# EAGLE design OEMV1_GPS_Interface (EAGLE 6.3)
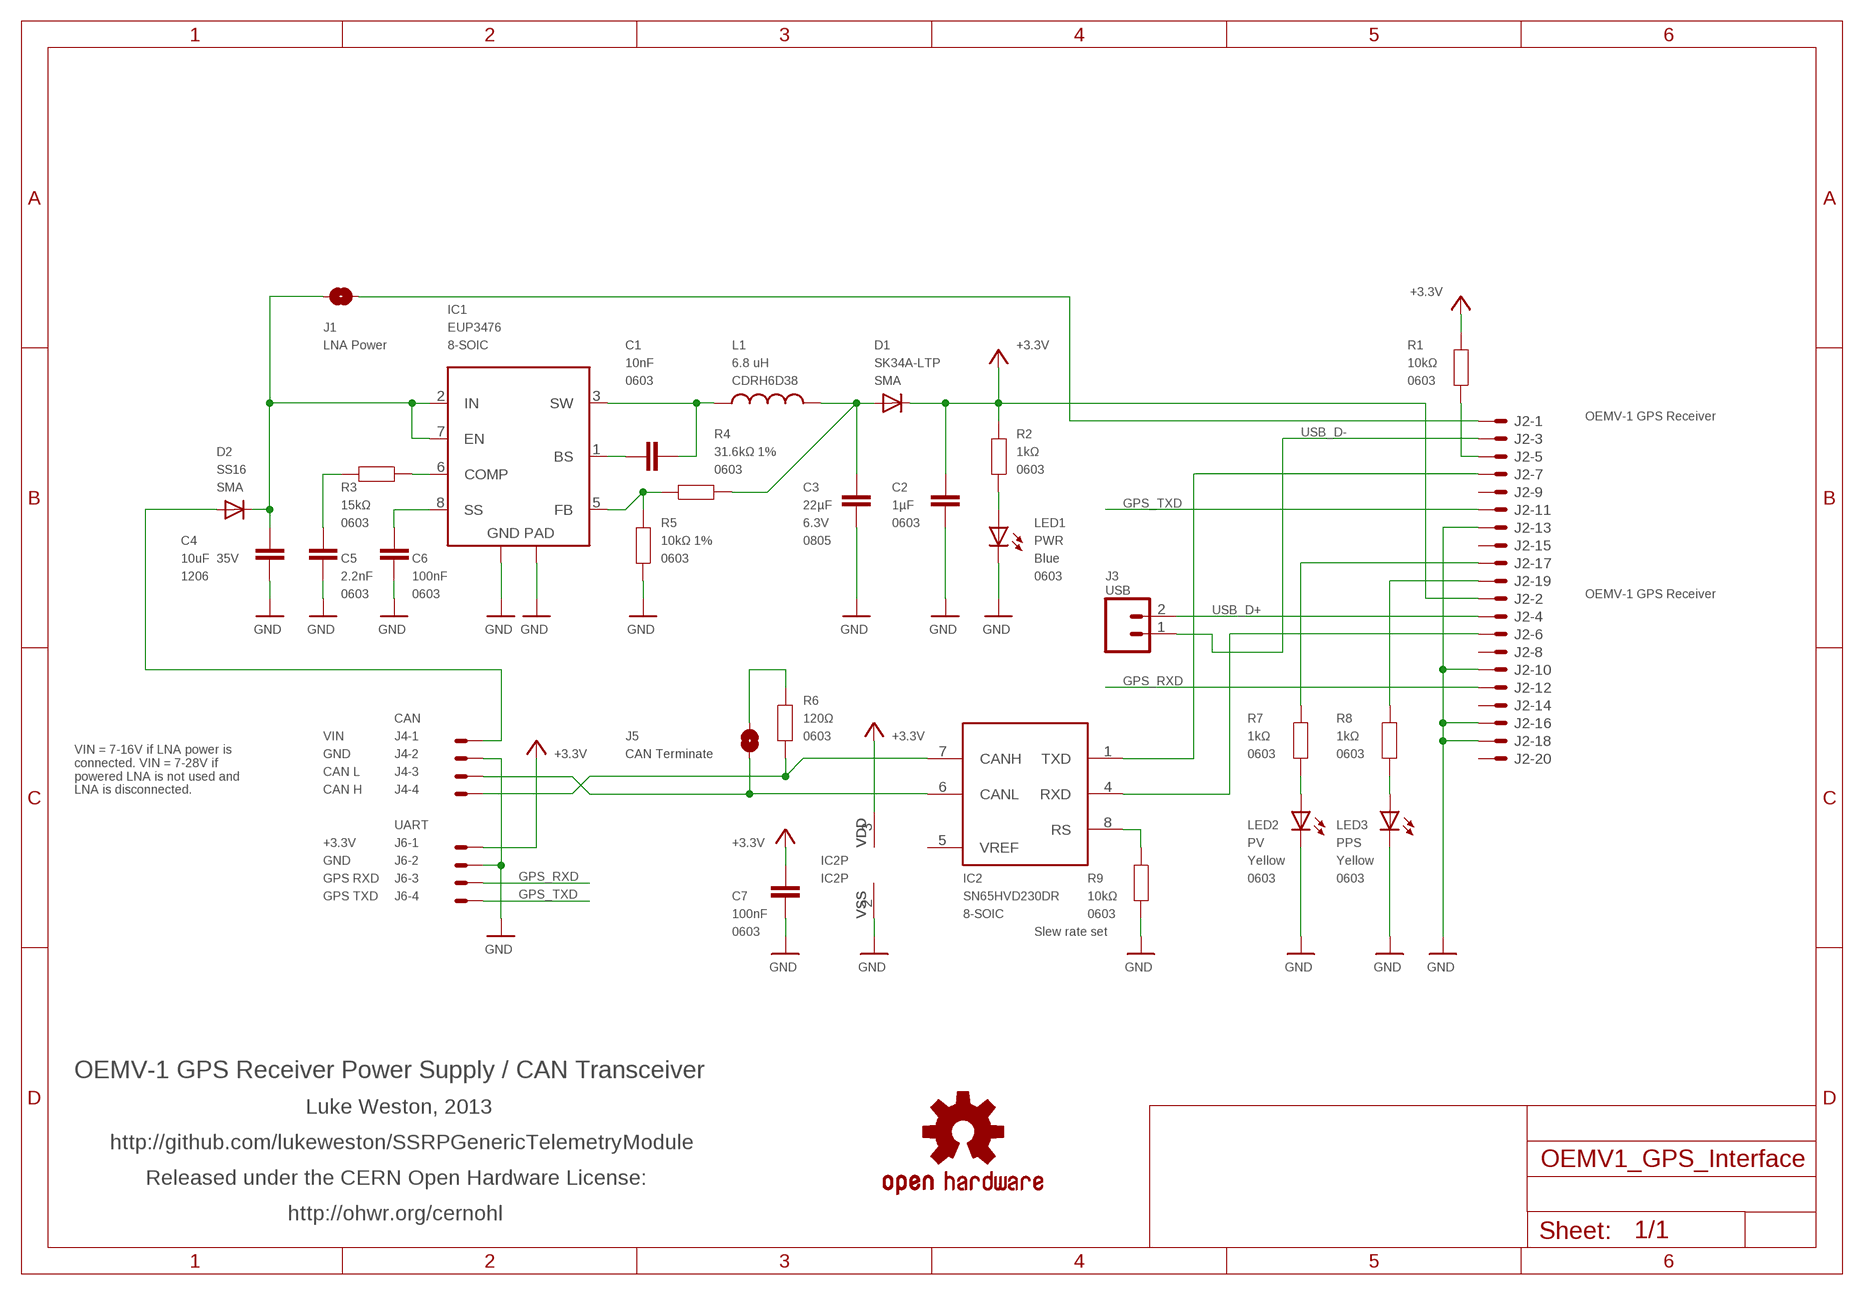
[diagram p0: schematic, sheet 1]

## Parts
C1  10nF  CAP0603  [0603]
C2  1µF  CAP0603  [0603]
C3  22µF  CAP0805  [0805]
C4  10uF  C-EUC1206  [C1206]
C5  2.2nF  CAP0603  [0603]
C6  100nF  CAP0603  [0603]
C7  100nF  CAP0603  [0603]
D1  SK34A-LTP  DIODESMA  [SMA-DIODE]
D2  SS16  DIODESMA  [SMA-DIODE]
IC1  EUP3476  [SO08T]
IC2  SN65HVD230DR  MCP2551SN  [SO-08]
J1  LNA Power  SJ  [SJ]
J2  OEMV-1 GPS Receiver  87758-2016  [87758-2016]
J3  USB  M02PTH  [1X02]
J4  CAN  22-23-2041  [22-23-2041]
J5  CAN Terminate  SJ  [SJ]
J6  UART  22-23-2041  [22-23-2041]
L1  6.8 uH  INDUCTOR  [CDRH]
LED1  PWR  LED0603  [LED-0603]
LED2  PV  LED0603  [LED-0603]
LED3  PPS  LED0603  [LED-0603]
R1  10kΩ  RESISTOR0603  [0603]
R2  1kΩ  RESISTOR0603  [0603]
R3  15kΩ  RESISTOR0603  [0603]
R4  31.6kΩ 1%  RESISTOR0603  [0603]
R5  10kΩ 1%  RESISTOR0603  [0603]
R6  120Ω  RESISTOR0603  [0603]
R7  1kΩ  RESISTOR0603  [0603]
R8  1kΩ  RESISTOR0603  [0603]
R9  10kΩ  RESISTOR0603  [0603]
SY  OSHW-LOGOS  [OSHW-LOGO-S]

## Nets
!RESET: J2.5 R1.2
+3.3V: C2.2 C7.2 D1.C IC2.3(VDD) J2.2 J6.1 R1.1 R2.1
CANH: IC2.7(CANH) J4.4 R6.1
CANL: IC2.6(CANL) J4.3 J5.2
GND: C2.1 C3.2 C4.2 C5.1 C6.1 C7.1 IC1.4(GND) IC1.9(TGND) IC2.2(VSS) J2.10 J2.13 J2.16 J2.18 J4.2 J6.2 LED1.C LED2.C LED3.C R5.2 R9.2
GPS_CAN_RX: IC2.4(RXD) J2.6
GPS_CAN_TX: IC2.1(TXD) J2.7
GPS_RXD: J2.12 J6.3
GPS_TXD: J2.11 J6.4
N$1: LED2.A R7.1
N$2: LED3.A R8.1
N$3: C1.2 IC1.1(BS)
N$4: D2.A J4.1
N$5: J5.1 R6.2
N$6: C5.2 R3.2
N$7: C3.1 D1.A L1.2 R4.2
N$9: LED1.A R2.2
N$11: C4.1 D2.C IC1.2(IN) IC1.7(EN) J1.1
N$18: C1.1 IC1.3(SW) L1.1
N$21: IC1.6(COMP) R3.1
N$22: C6.2 IC1.8(SS)
N$23: IC1.5(FB) R4.1 R5.1
N$87: IC2.8(RS) R9.1
PPS_OUT: J2.19 R8.2
PV_OUT: J2.17 R7.2
USB_D+: J2.4 J3.2
USB_D-: J2.3 J3.1
VIN: J1.2 J2.1
Unconnected: J2.8 J2.9 J2.14 J2.15 J2.20

## Notes on the sheet
- VIN
- GND
- CAN L
- VIN = 7-16V if LNA power is
  connected. VIN = 7-28V if
  powered LNA is not used and
  LNA is disconnected.
- CAN H
- +3.3V
- GND
- GPS RXD
- GPS TXD
- OEMV-1 GPS Receiver Power Supply / CAN Transceiver
- Luke Weston, 2013
- http://github.com/lukeweston/SSRPGenericTelemetryModule
- Released under the CERN Open Hardware License:
- http://ohwr.org/cernohl

## Power pins joined to a net without a drawn wire
VREF: IC2.5(VREF)

## Library data of the parts
C1 C2 C5-C7 = freetronics-master-v1:CAP: Capacitor Standard 0603 ceramic capacitor, and 0.1" leaded capacitor.; PACKAGE: 0603
C3 = freetronics-master-v1:CAP: Capacitor Standard 0603 ceramic capacitor, and 0.1" leaded capacitor.; PACKAGE: 0805; VOLTAGE: 6.3V
C4 = freetronics-jon:C-EU: CAPACITOR, European symbol; PACKAGE: 1206; VOLTAGE: 35V
D1 D2 = freetronics-master-v1:DIODE: Diode These are standard reverse protection diodes and small signal diodes. SMA package can handle up to about 1A. SOD-323 can handle about 200mA. What the SOD-323 package when ordering, there are some mfgs out there that are 5-pin packages.; PACKAGE: SMA
IC1 = freetronics-luke:EUP3476: EUTECH EUP3476 buck converter; PACKAGE: 8-SOIC
IC2 = microchip_can:MCP2551: High Speed CAN tranceiver; PACKAGE: 8-SOIC
J1 J5 = freetronics-luke:SJ: PCB "solder jumper". Note that there should nothing on the BOM corresponding to this "component".
J2 = con-molex:87758-2016: 20 Pin - 2mm Dual Row Single Wafer, Vertical T/H HDR Source: http://www.molex.com/pdm_docs/sd/877580616_sd.pdf; MPN: 87758-2016; OC_FARNELL: 7472374; OC_NEWARK: 25M5677
J3 = freetronics-master-v1:M02: Header 2 Standard 2-pin 0.1" header. Use with straight break away headers (SKU : PRT-00116), right angle break away headers (PRT-00553), swiss pins (PRT-00743), machine pins (PRT-00117), and female headers (PRT-00115). Molex polarized connector foot print use with SKU : PRT-08233 with associated crimp pins and housings.
J4 J6 = con-molex:22-23-2041: .100" (2.54mm) Center Header - 4 Pin; MF: MOLEX; MPN: 22-23-2041; OC_FARNELL: 1462920; OC_NEWARK: 38C0355
L1 = freetronics-luke:INDUCTOR; SKU: CDRH6D38
LED1 = freetronics-master-v1:LED: LEDs Standard schematic elements and footprints for 5mm, 3mm, 1206, and 0603 sized LEDs. 5mm - Spark Fun Electronics SKU : COM-00529 (and others); COLOUR: Blue; PACKAGE: 0603
LED2 LED3 = freetronics-master-v1:LED: LEDs Standard schematic elements and footprints for 5mm, 3mm, 1206, and 0603 sized LEDs. 5mm - Spark Fun Electronics SKU : COM-00529 (and others); COLOUR: Yellow; PACKAGE: 0603
R1-R8 = freetronics-master-v1:RESISTOR: Resistor Basic schematic elements and footprints for 0603, 1206, and PTH 1/10th watt (small) resistors.; PACKAGE: 0603
R9 = freetronics-master-v1:RESISTOR: Resistor Basic schematic elements and footprints for 0603, 1206, and PTH 1/10th watt (small) resistors.; FUNCTION: Slew rate set; PACKAGE: 0603
SY = SparkFun:OSHW-LOGO: Open Source Hardware Logo This logo indicates the piece of hardware it is found on incorporates a OSHW license and/or adheres to the definition of open source hardware found here: http://freedomdefined.org/OSHW

## Board
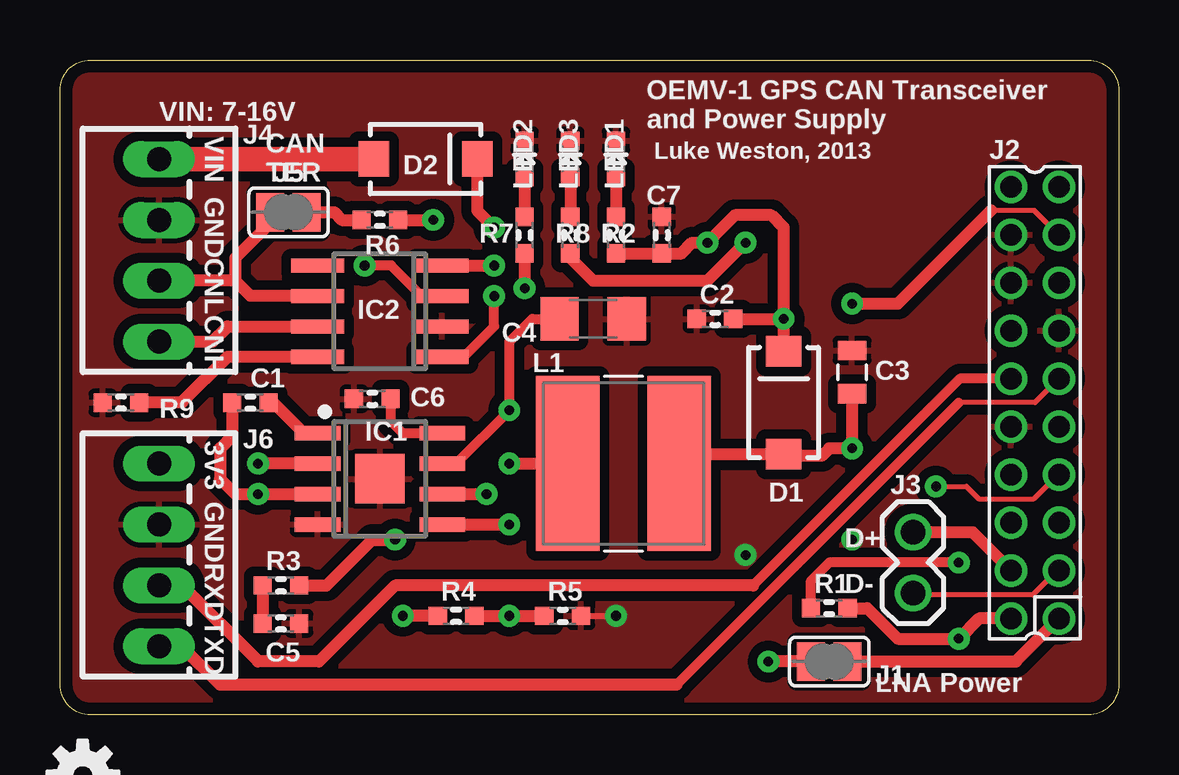
[diagram p1: board, top side]
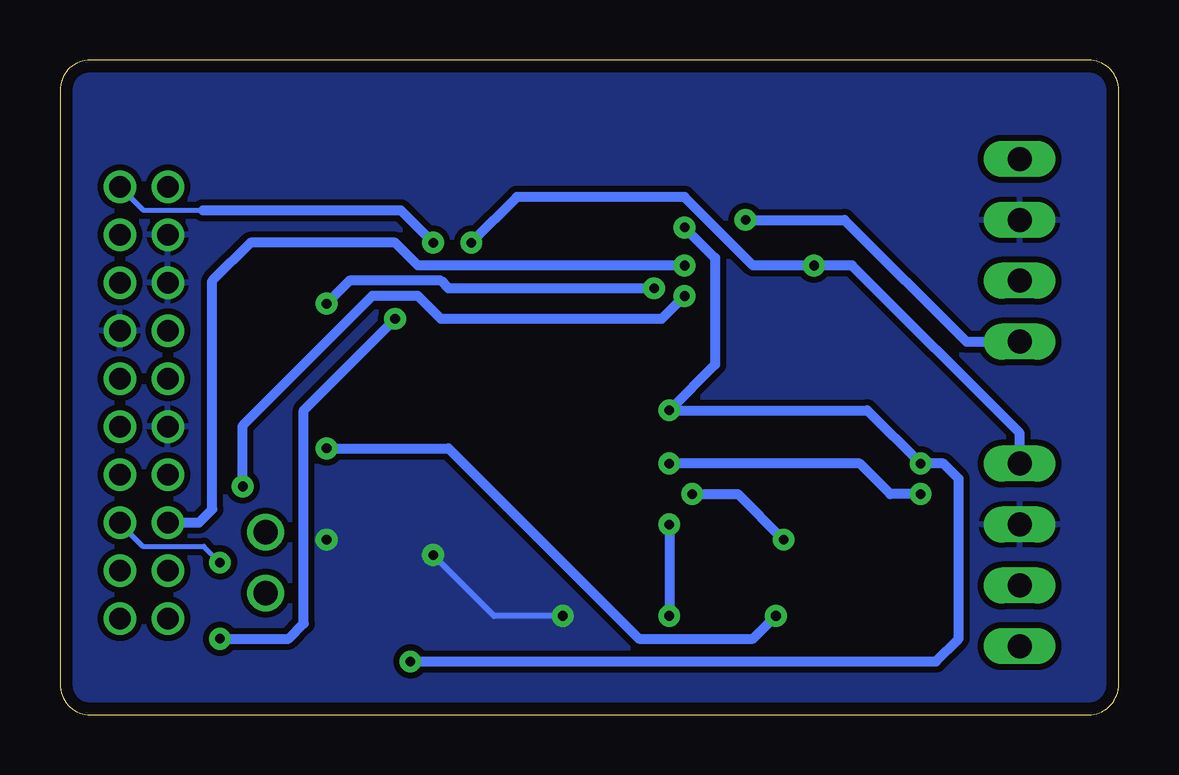
[diagram p2: board, bottom side, seen from below]

Size 44.13 x 27.3 mm. Coordinates in mm from the lower left corner, seen from the top.
Outline: 0,1.27 0,26.04 arc-90 1.27,27.3 42.86,27.3 arc-90 44.13,26.04 44.13,1.27 arc-90 42.86,0 1.27,0 arc-90 0,1.27
Copper layers (1*16): Top 0.035mm / dielectric 1.5mm / Bottom 0.035mm
Design rules "PCBCart-Standard *": minimum track width 8mil, minimum drill 0.4mm, track to track 8mil, track to pad 8mil, pad to pad 8mil, via to via 8mil, smd to smd 8mil, copper to edge 20mil, drill to drill 8mil, minimum pad ring 8mil, minimum via ring 10mil, stop-mask expansion 3mil, vias tented up to drill 16mil, thermal gap 8mil

### Footprints (pad centres in the part's own frame; a part is rotated, then mirrored left to right if it is on the bottom)
0603 = smd 0.762 x 0.762: 1 -0.762,0; 2 0.762,0
0805 = smd 0.8 x 1.2: 1 -0.9,0; 2 0.9,0
C1206 = smd 1.6 x 1.8: 1 -1.4,0; 2 1.4,0
SMA-DIODE = smd 1.27 x 1.47: A -2.15,0; C 2.15,0
SO08T = smd 1.905 x 0.6: 1 -2.6,1.905; 2 -2.6,0.635; 3 -2.6,-0.635; 4 -2.6,-1.905; 5 2.6,-1.905; 6 2.6,-0.635; 7 2.6,0.635; 8 2.6,1.905 | smd 2.057 x 2.057: 9 0,0
SO-08 = smd 0.6 x 2.2: 1 -1.905,-2.6; 2 -0.635,-2.6; 3 0.635,-2.6; 4 1.905,-2.6; 5 1.905,2.6; 6 0.635,2.6; 7 -0.635,2.6; 8 -1.905,2.6
SJ = smd 1.168 x 1.6: 1 -0.762,0; 2 0.762,0
87758-2016 = drill 0.9 pad 1.27: 1 -9,-1; 2 -9,1; 3 -7,-1; 4 -7,1; 5 -5,-1; 6 -5,1; 7 -3,-1; 8 -3,1; 9 -1,-1; 10 -1,1; 11 1,-1; 12 1,1; 13 3,-1; 14 3,1; 15 5,-1; 16 5,1; 17 7,-1; 18 7,1; 19 9,-1; 20 9,1
1X02 = drill 1.016: 1 0,0; 2 2.54,0
22-23-2041 = drill 1 long: 1 -3.81,0; 2 -1.27,0; 3 1.27,0; 4 3.81,0
CDRH = smd 7.3 x 2.65: 1 0,2.325; 2 0,-2.325
LED-0603 = smd 0.762 x 0.762: A -0.762,0; C 0.762,0

### Placement (x,y rotation side)
C1  7.94,13.02 0 top
C2  27.3,16.51 0 top
C3  33.02,14.29 90 top
C4  22.22,16.51 0 top
C5  9.21,3.81 180 top
C6  13.02,13.18 0 top
C7  25.08,20 270 top
D1  30.16,13.02 90 top
D2  15.24,23.18 0 top
IC1  13.33,9.84 0 top
IC2  13.33,16.83 90 top
J1  32.07,2.22 0 top
J2  40.64,13.02 90 top
J3  35.56,5.08 90 top
J4  4.13,19.37 270 top
J5  9.52,20.95 180 top
J6  4.13,6.67 270 top
L1  23.5,10.48 90 top
LED1  23.18,23.18 90 top
LED2  19.37,23.18 90 top
LED3  21.27,23.18 90 top
R1  32.07,4.45 180 top
R2  23.18,20 90 top
R3  9.21,5.4 180 top
R4  16.51,4.13 180 top
R5  20.95,4.13 0 top
R6  13.33,20.64 180 top
R7  19.37,20 270 top
R8  21.27,20 270 top
R9  2.54,13.02 180 top
SY  0.95,-2.54 0 top

### Tracks (layer width: path | path; a pad name or v marks a point on that pad's centre or on a via)
!RESET  (via drill 0.4)
  Top 0.406: v37.46,6.35 32.07,6.35 31.31,5.59 R1.2
  Bottom 0.203: J2.5 41.64,7.98 40.68,7.03 38.14,7.03 v37.46,6.35
+3.3V  (via drill 0.4)
  Top 0.406: IC2.3 15.08,17.46 13.81,18.73 v12.7,18.73
  Top 0.508: v30.16,16.51 D1.C | R1.1 33.66,4.45 34.92,3.17 v37.46,3.17 38.31,4.02 J2.2 | C2.2 v30.16,16.51 | v30.16,16.51 30.16,20.32 29.65,20.83 28.13,20.83 v26.99,19.68 26.35,19.68 25.91,19.24 C7.2 R2.1
  Bottom 0.406: v37.46,3.17 34.61,3.17 33.97,3.81 33.97,12.7 v30.16,16.51 | v26.99,19.68 25.08,21.59 18.1,21.59 15.24,18.73 v12.7,18.73 11.11,18.73 4.13,11.75 J6.1
CANH  (via drill 0.4)
  Top 0.508: J4.4 6.35,15.56 6.99,16.19 IC2.7 | R6.1 v15.56,20.64
  Bottom 0.406: J4.4 6.35,15.56 11.43,20.64 v15.56,20.64
CANL
  Top 0.406: J5.2 8.76,20.51
  Top 0.508: IC2.6 7.94,17.46 7.3,18.1 | 7.3,18.1 J4.3 | 8.76,20.51 7.3,19.05 7.3,18.1
GND  (via drill 0.4)
  Top 0.254: R5.2 v23.18,4.13
  Bottom 0.254: v23.18,4.13 26.04,4.13 v28.57,6.67
  other vias: 33.02,7.3
  pour Top (isolate 0.406): -0.64,27.94 44.77,27.94 44.77,-0.64 -0.64,-0.64
  pour Bottom (isolate 0.254): -0.64,27.94 44.77,27.94 44.77,-0.64 -0.64,-0.64
GPS_CAN_RX  (via drill 0.4)
  Top 0.508: IC2.4 v18.1,18.73
  Bottom 0.406: v18.1,18.73 29.21,18.73 30.16,19.68 36.2,19.68 37.78,18.1 37.78,8.57 38.34,8.02 J2.6
GPS_CAN_TX  (via drill 0.4)
  Top 0.203: J2.7 41.61,10.02 40.6,9.01 38.3,9.01 37.78,9.53 v36.51,9.53
  Top 0.406: IC2.1 16.83,14.92 18.1,16.19 v18.1,17.46
  Bottom 0.406: v36.51,9.53 36.51,12.06 31.12,17.46 29.21,17.46 28.26,16.51 19.05,16.51 v18.1,17.46
GPS_RXD
  Top 0.406: 28.89,5.4 37.51,14.02 J2.12
  Top 0.508: 28.89,5.4 13.97,5.4 10.8,2.22 8.25,2.22 5.08,5.4 J6.3
GPS_TXD
  Top 0.203: J2.11 40.64,13.02 37.46,13.02
  Top 0.406: 37.46,13.02 27.31,2.86 25.72,1.27
  Top 0.508: J6.4 5.08,2.86 6.67,1.27 25.72,1.27
N$1
  Top 0.508: LED2.A R7.1
N$2
  Top 0.508: LED3.A R8.1
N$3
  Top 0.406: C1.2 8.89,13.02 | 10.16,11.75 IC1.1
  Top 0.508: 8.89,13.02 10.16,11.75
N$4
  Top 1.016: J4.1 D2.A
N$5
  Top 0.508: J5.1 11.43,20.95 11.75,20.64 R6.2
N$6
  Top 0.508: R3.2 C5.2
N$7  (via drill 0.4)
  Top 0.203: L1.2 25.89,10.48 26.28,10.87
  Top 0.254: 26.28,10.87 25.72,11.43 25.08,11.43 | 30.24,10.79 D1.A
  Top 0.508: D1.A 26.28,10.87 | R4.2 v14.29,4.13 | C3.1 v33.02,11.11 32.07,11.11 31.75,10.79 30.24,10.79
  Bottom 0.406: v14.29,4.13 15.24,3.17 20,3.17 27.94,11.11 v33.02,11.11
N$9
  Top 0.508: LED1.A R2.2
N$11  (via drill 0.4)
  Top 0.254: IC1.7 16.51,10.48
  Top 0.406: C4.1 19.68,16.51 18.73,15.56 v18.73,12.7 16.51,10.48
  Top 0.508: IC1.2 v8.25,10.48 | D2.C 17.39,21.03 v18.1,20.32 | J1.1 v29.53,2.22
  Bottom 0.406: v18.1,20.32 16.83,19.05 16.83,14.61 v18.73,12.7 10.48,12.7 v8.25,10.48 7.3,10.48 6.67,9.84 6.67,3.17 7.62,2.22 v29.53,2.22
N$18  (via drill 0.4)
  Top 0.508: IC1.3 v8.25,9.21 7.3,9.21 6.67,9.84 6.67,11.11 7.18,11.62 C1.1 | v18.73,10.48 L1.1
  Bottom 0.406: v8.25,9.21 9.52,9.21 10.8,10.48 v18.73,10.48
N$21  (via drill 0.4)
  Top 0.508: v13.97,7.3 13.02,7.3 11.11,5.4 R3.1 | IC1.6 v17.78,9.21
  Bottom 0.406: v13.97,7.3 15.88,9.21 v17.78,9.21
N$22
  Top 0.406: C6.2 13.78,12.26 14.29,11.75 IC1.8
N$23  (via drill 0.4)
  Top 0.508: IC1.5 v18.73,7.94 | R5.1 v18.73,4.13 R4.1
  Bottom 0.406: v18.73,7.94 v18.73,4.13
N$87
  Top 0.508: IC2.8 6.99,14.92 5.08,13.02 R9.1
PPS_OUT  (via drill 0.4)
  Top 0.406: R8.2 21.27,19.05
  Top 0.508: 21.27,19.05 22.22,18.1 26.99,18.1 v28.57,19.68
  Bottom 0.203: J2.19 40.66,21.03 38.18,21.03
  Bottom 0.406: v28.57,19.68 29.92,21.03 38.18,21.03
PV_OUT  (via drill 0.4)
  Top 0.203: J2.17 41.58,20.06 40.6,21.03 38.81,21.03
  Top 0.508: R7.2 v19.37,17.78 | v33.02,17.14 34.92,17.14 38.81,21.03
  Bottom 0.406: v19.37,17.78 27.94,17.78 28.26,18.1 32.07,18.1 v33.02,17.14
USB_D+
  Top 0.508: J3.2 38.04,7.62 J2.4
USB_D-
  Top 0.203: 41.58,6.02 40.56,5 35.64,5 J3.1
  Top 0.254: J2.3 41.58,6.02
VIN
  Top 0.508: J1.2 39.84,2.22 J2.1

### Text on the board
tPlace: VIN: 7-16V | VIN | OEMV-1 GPS CAN Transceiver / and Power Supply | Luke Weston, 2013 | CAN / TER | GND | CNL | CNH | 3V3 | GND | D+ | RXD | D- | TXD | LNA Power